# Altium schematic sheet Main.SchDoc
size A3
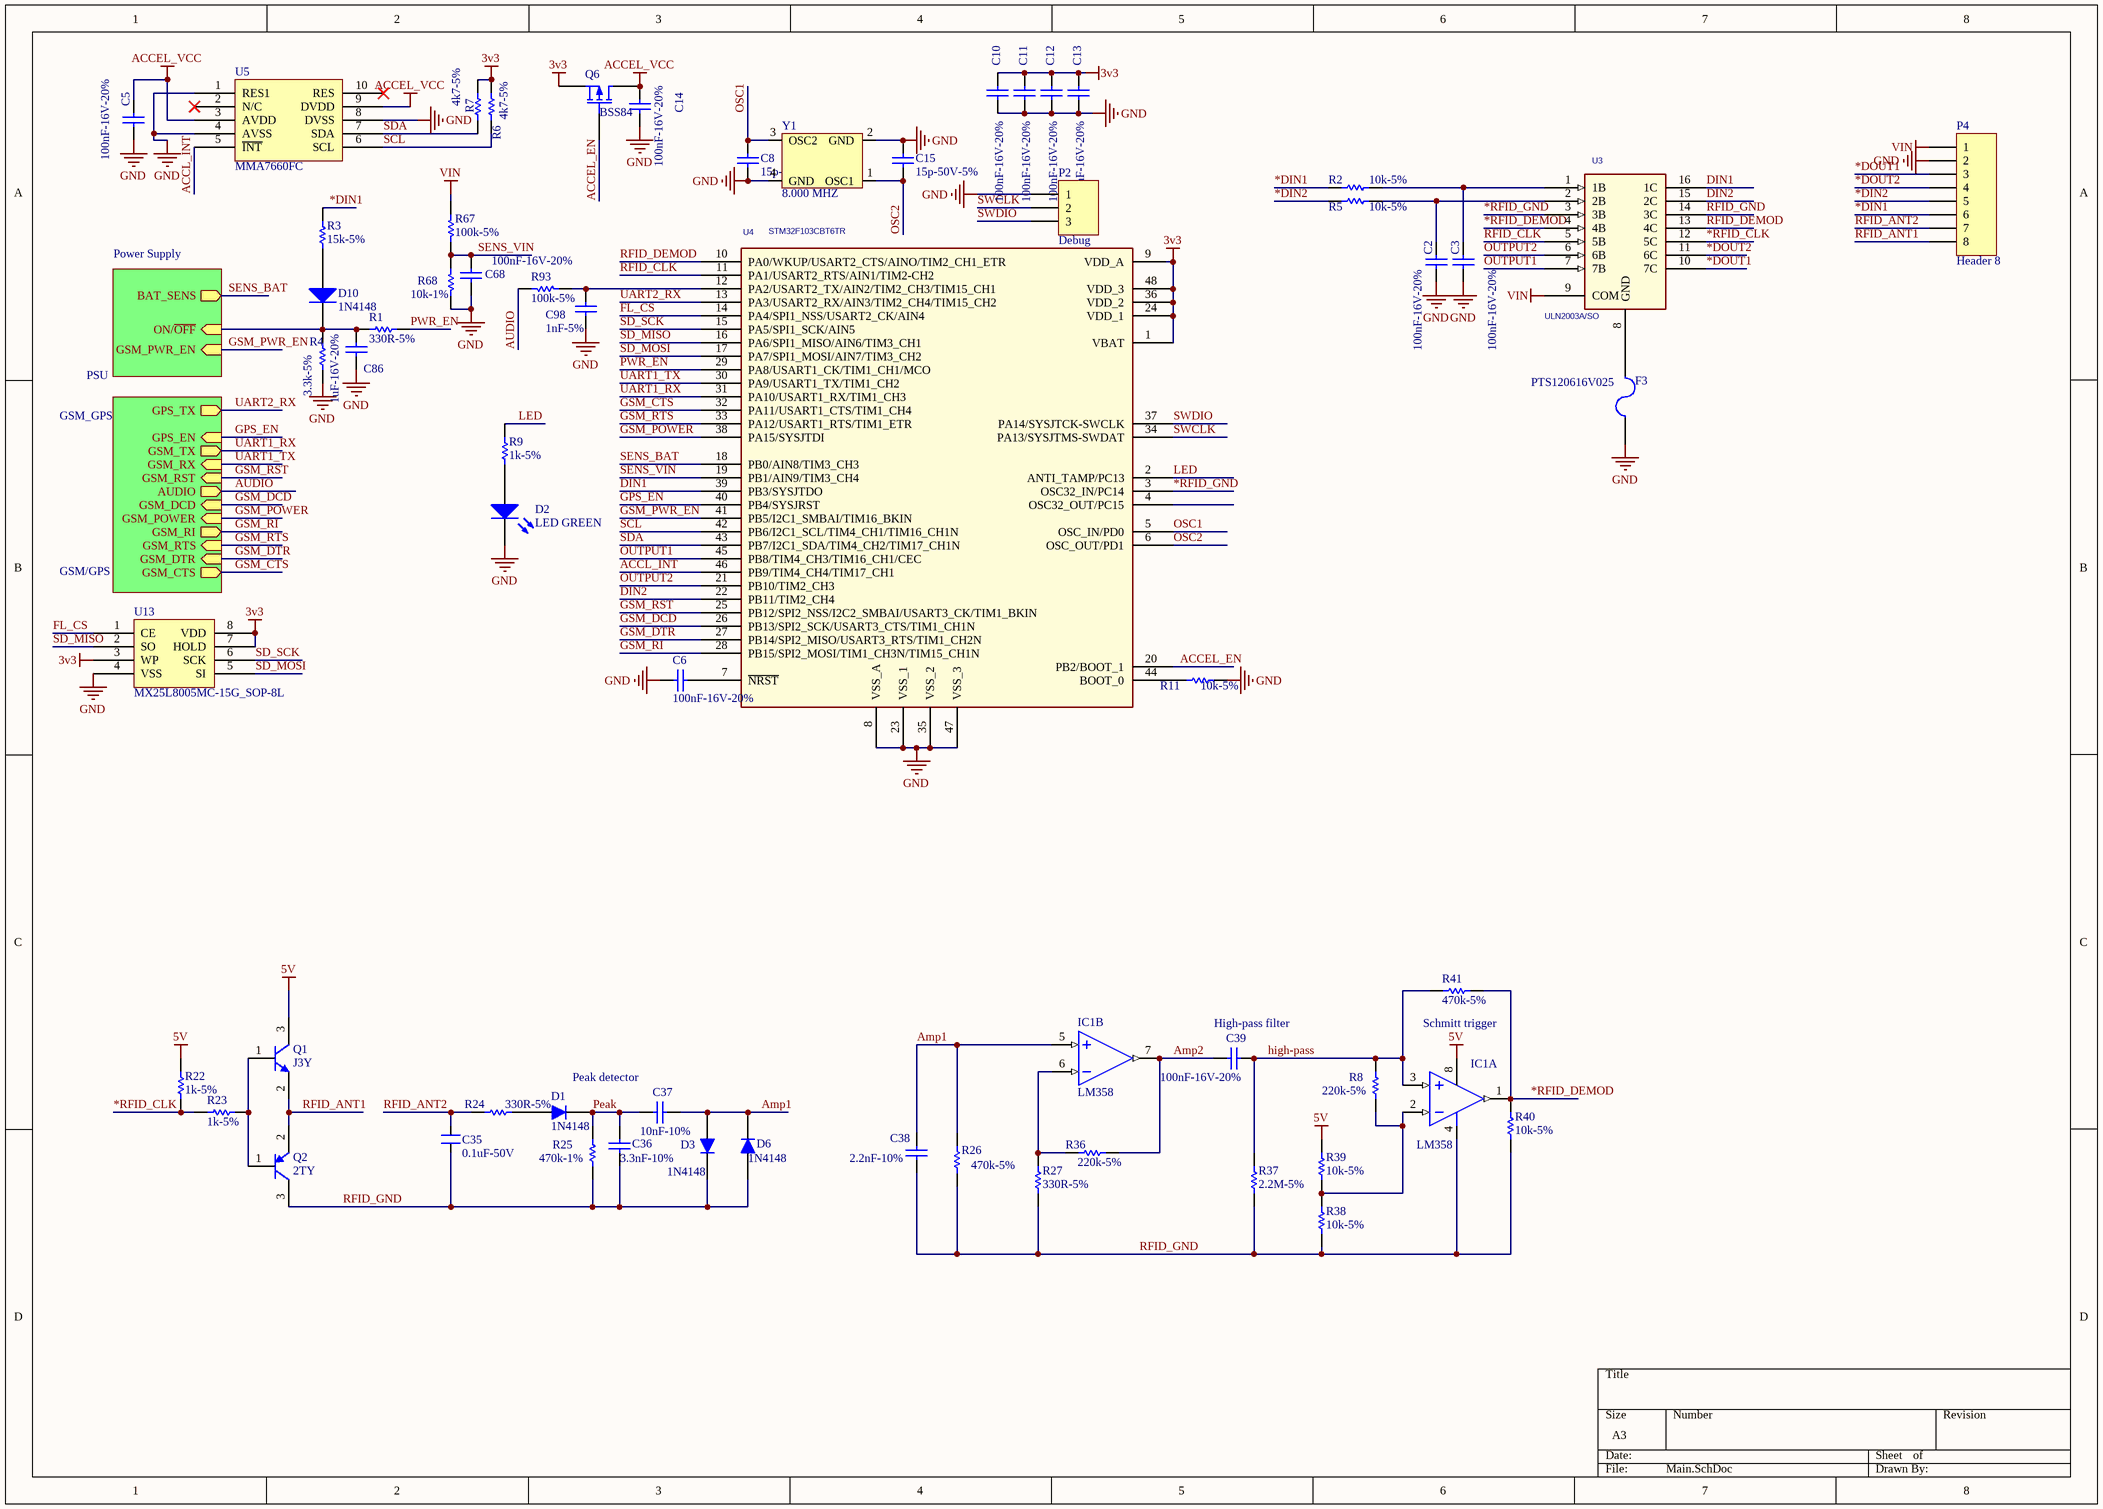
[diagram p0: Main.SchDoc]

## Parts
C2  100nF-16V-20%  [0402_TYPE1]
C3  100nF-16V-20%  [0402_TYPE1]
C5  100nF-16V-20%  [0402_TYPE1]
C6  100nF-16V-20%  [0402_TYPE1]
C8  15p-50V-5%  [0402_TYPE1]
C10  100nF-16V-20%  [0402_TYPE1]
C11  100nF-16V-20%  [0402_TYPE1]
C12  100nF-16V-20%  [0402_TYPE1]
C13  100nF-16V-20%  [0402_TYPE1]
C14  100nF-16V-20%  [0402_TYPE1]
C15  15p-50V-5%  [0402_TYPE1]
C35  0.1uF-50V  [C0805 - TYPE3]
C36  3.3nF-10%  [0402_TYPE1]
C37  10nF-10%  [0402_TYPE1]
C38  2.2nF-10%  [0402_TYPE1]
C39  100nF-16V-20%  [0402_TYPE1]
C68  100nF-16V-20%  [0402_TYPE1]
C86  1uF-16V-20%  [0402_TYPE1]
C98  1nF-5%  [0402_TYPE1]
D1  1N4148  [DO-213AA]
D2  LED GREEN  [LED0603-G]
D3  1N4148  [DO-213AA]
D6  1N4148  [DO-213AA]
D10  1N4148  [SOD323]
F3  PTS120616V025  [PTC1206]
IC1  LM358  [soic8]  (parts A,B of 2)
P2  Debug  [HEADER_1.27mm_3PIN]
P4  Header 8  [HDR1X8]
Q1  J3Y  [SOT23_123]
Q2  2TY  [SOT23_123]
Q6  BSS84  [SOT23-3]
R1  330R-5%  [R0402_TYPE1]
R2  10k-5%  [R0402_TYPE1]
R3  15k-5%  [R0402_TYPE1]
R4  3.3k-5%  [R0402_TYPE1]
R5  10k-5%  [R0402_TYPE1]
R6  4k7-5%  [R0402_TYPE1]
R7  4k7-5%  [R0402_TYPE1]
R8  220k-5%  [R0402_TYPE1]
R9  1k-5%  [R0402_TYPE1]
R11  10k-5%  [R0402_TYPE1]
R22  1k-5%  [R0402_TYPE1]
R23  1k-5%  [R0402_TYPE1]
R24  330R-5%  [R0402_TYPE1]
R25  470k-1%  [R0402_TYPE1]
R26  470k-5%  [R0402_TYPE1]
R27  330R-5%  [R0402_TYPE1]
R36  220k-5%  [R0402_TYPE1]
R37  2.2M-5%  [R0402_TYPE1]
R38  10k-5%  [R0402_TYPE1]
R39  10k-5%  [R0402_TYPE1]
R40  10k-5%  [R0402_TYPE1]
R41  470k-5%  [R0402_TYPE1]
R67  100k-5%  [R0402_TYPE1]
R68  10k-1%  [R0402_TYPE1]
R93  100k-5%  [R0402_TYPE1]
U3  ULN2003A/SO  [SO16-150mil]
U4  STM32F103CBT6TR  [TQFP-48-P0.5]
U5  MMA7660FC  [MMA7660FC]
U13  MX25L8005MC-15G_SOP-8L  [SO8-200mil]
Y1  8.000 MHZ  [SMD CRYSTAL 4 x 2.5]

## Sub-sheets
GSM/GPS = GSM_GPS: GSM_POWER (in), GSM_RX (in), GSM_TX (out), GPS_TX (out), GSM_DCD (in), GSM_RI (out), GPS_EN (in), GSM_RST (in), GSM_RTS (in), GSM_DTR (in), GSM_CTS (out), AUDIO (out)
Power Supply = PSU: ON/~{OFF} (in), GSM_PWR_EN (in), BAT_SENS (out)

## Nets
3v3: C10.1 C11.1 C12.1 C13.1 Q6.2(S) R6.2 R7.2 U4.1(VBAT) U4.9(VDD_A) U4.24(VDD_1) U4.36(VDD_2) U4.48(VDD_3) U13.3(WP) U13.7(HOLD) U13.8(VDD)
5V: IC1.8(+V) Q1.3(C) R22.2 R39.1
ACCEL_VCC: C5.2 C14.2 Q6.3(D) U5.3(AVDD) U5.9(DVDD)
GND: C2.2 C3.2 C5.1 C6.2 C8.1 C10.2 C11.2 C12.2 C13.2 C14.1 C15.2 C68.1 C86.1 C98.1 D2.2(K) F3.2 P2.1 P4.2 R4.1 R11.1 R68.1 U4.8(VSS_A) U4.23(VSS_1) U4.35(VSS_2) U4.47(VSS_3) U5.1(RES1) U5.4(AVSS) U5.8(DVSS) U13.4(VSS) Y1.2(GND) Y1.4(GND)
VIN: P4.1 R67.1 U3.9(COM)
*DIN1: P4.6 R2.2 R3.2
*DIN2: P4.5 R5.2
*DOUT1: P4.3 U3.10(7C)
*DOUT2: P4.4 U3.11(6C)
*RFID_CLK: R22.1 R23.2 U3.12(5C)
*RFID_DEMOD: IC1.1(OUT) R40.2 R41.1 U3.4(4B)
*RFID_GND: U3.3(3B) U4.3(OSC32_IN/PC14)
ACCEL_EN: Q6.1(G) U4.20(PB2/BOOT_1)
ACCL_INT: U4.46(PB9/TIM4_CH4/TIM17_CH1) U5.5(~{INT})
Amp1: C37.2 C38.2 D3.1(A) D6.2(K) IC1.5(IN+) R26.1
Amp2: C39.2 IC1.7(OUT) R36.1
AUDIO: R93.1 ; sheet GSM/GPS/AUDIO
DIN1: U3.16(1C) U4.39(PB3/SYSJTDO)
DIN2: U3.15(2C) U4.22(PB11/TIM2_CH4)
FL_CS: U4.14(PA4/SPI1_NSS/USART2_CK/AIN4) U13.1(CE)
GPS_EN: U4.40(PB4/SYSJRST) ; sheet GSM/GPS/GPS_EN
GSM_CTS: U4.32(PA11/USART1_CTS/TIM1_CH4) ; sheet GSM/GPS/GSM_CTS
GSM_DCD: U4.26(PB13/SPI2_SCK/USART3_CTS/TIM1_CH1N) ; sheet GSM/GPS/GSM_DCD
GSM_DTR: U4.27(PB14/SPI2_MISO/USART3_RTS/TIM1_CH2N) ; sheet GSM/GPS/GSM_DTR
GSM_POWER: U4.38(PA15/SYSJTDI) ; sheet GSM/GPS/GSM_POWER
GSM_PWR_EN: U4.41(PB5/I2C1_SMBAI/TIM16_BKIN) ; sheet Power Supply/GSM_PWR_EN
GSM_RI: U4.28(PB15/SPI2_MOSI/TIM1_CH3N/TIM15_CH1N) ; sheet GSM/GPS/GSM_RI
GSM_RST: U4.25(PB12/SPI2_NSS/I2C2_SMBAI/USART3_CK/TIM1_BKIN) ; sheet GSM/GPS/GSM_RST
GSM_RTS: U4.33(PA12/USART1_RTS/TIM1_ETR) ; sheet GSM/GPS/GSM_RTS
high-pass: C39.1 IC1.3(IN+) R8.2 R37.2 R41.2
LED: R9.2 U4.2(ANTI_TAMP/PC13)
OSC1: C8.2 U4.5(OSC_IN/PD0) Y1.3(OSC2)
OSC2: C15.1 U4.6(OSC_OUT/PD1) Y1.1(OSC1)
OUTPUT1: U3.7(7B) U4.45(PB8/TIM4_CH3/TIM16_CH1/CEC)
OUTPUT2: U3.6(6B) U4.21(PB10/TIM2_CH3)
Peak: C36.1 C37.1 D1.2(K) R25.1
PWR_EN: R1.1 U4.29(PA8/USART1_CK/TIM1_CH1/MCO)
RFID_ANT1: P4.8 Q1.2(E) Q2.2(E)
RFID_ANT2: C35.2 P4.7 R24.2
RFID_CLK: U3.5(5B) U4.11(PA1/USART2_RTS/AIN1/TIM2-CH2)
RFID_DEMOD: U3.13(4C) U4.10(PA0/WKUP/USART2_CTS/AINO/TIM2_CH1_ETR)
RFID_GND: C35.1 C36.2 C38.1 D3.2(K) D6.1(A) IC1.4(-V) Q2.3(C) R25.2 R26.2 R27.1 R37.1 R38.2 R40.1 U3.14(3C)
SCL: R6.1 U4.42(PB6/I2C1_SCL/TIM4_CH1/TIM16_CH1N) U5.6(SCL)
SD_MISO: U4.16(PA6/SPI1_MISO/AIN6/TIM3_CH1) U13.2(SO)
SD_MOSI: U4.17(PA7/SPI1_MOSI/AIN7/TIM3_CH2) U13.5(SI)
SD_SCK: U4.15(PA5/SPI1_SCK/AIN5) U13.6(SCK)
SDA: R7.1 U4.43(PB7/I2C1_SDA/TIM4_CH2/TIM17_CH1N) U5.7(SDA)
SENS_BAT: U4.18(PB0/AIN8/TIM3_CH3) ; sheet Power Supply/BAT_SENS
SENS_VIN: C68.2 R67.2 R68.2 U4.19(PB1/AIN9/TIM3_CH4)
SWCLK: P2.2 U4.34(PA13/SYSJTMS-SWDAT)
SWDIO: P2.3 U4.37(PA14/SYSJTCK-SWCLK)
UART1_RX: U4.31(PA10/USART1_RX/TIM1_CH3) ; sheet GSM/GPS/GSM_TX
UART1_TX: U4.30(PA9/USART1_TX/TIM1_CH2) ; sheet GSM/GPS/GSM_RX
UART2_RX: U4.13(PA3/USART2_RX/AIN3/TIM2_CH4/TIM15_CH2) ; sheet GSM/GPS/GPS_TX
NetC2_1: C2.1 R5.1 U3.2(2B)
NetC3_1: C3.1 R2.1 U3.1(1B)
NetC6_1: C6.1 U4.7(~{NRST})
NetC86_2: C86.2 D10.2(K) R1.2 R4.2 ; sheet Power Supply/ON/~{OFF}
NetC98_2: C98.2 R93.2 U4.12(PA2/USART2_TX/AIN2/TIM2_CH3/TIM15_CH1)
NetD1_1: D1.1(A) R24.1
NetD2_1: D2.1(A) R9.1
NetD10_1: D10.1(A) R3.1
NetF3_1: F3.1 U3.8(GND)
NetIC1_2: IC1.2(IN-) R8.1 R38.1 R39.2
NetIC1_6: IC1.6(IN-) R27.2 R36.2
NetQ1_1: Q1.1(B) Q2.1(B) R23.1
NetR11_2: R11.2 U4.44(BOOT_0)

Not connected (* = marked no-connect by the designer): U4 4(OSC32_OUT/PC15); U5 2(N/C)* 10(RES)*

## Notes on the sheet
- (near C39) High-pass filter
- (near R41) Schmitt trigger
- Peak detector

## Library data of the parts
C2 C3 C5 C6 C10-C14 C39 C68 = Cap: CAP CER 0.1UF 16V Y5V 0402; Manufacturer: Yageo; Manufacturer Part Number: CC0402ZRY5V7BB104; Published: 8-Jun-2000; LatestRevisionDate: 17-Jul-2002; LatestRevisionNote: Re-released for DXP Platform.; PackageReference: C0402; Publisher: Altium Limited; Value: 100nF-16V-20%; Digi-Key Part Number: 311-1047-1-ND; Unit Price: 0.00250
C8 C15 = Cap: CAP CER 15PF 50V 5% NPO 0402; Manufacturer: Yageo; Manufacturer Part Number: CC0402JRNPO9BN150; Published: 8-Jun-2000; LatestRevisionDate: 17-Jul-2002; LatestRevisionNote: Re-released for DXP Platform.; PackageReference: C0402; Publisher: Altium Limited; Value: 15p-50V-5%; Digi-Key Part Number: 311-1017-1-ND; Unit Price: 0.00270
C35 = CN2: CAP CER 0.1UF 50V Y5V 0603; Manufacturer: Yageo; Manufacturer Part Number: CC0603ZRY5V9BB104; Digi-Key Part Number: 311-1343-2-ND; Unit Price: 0.00327; Value: 0.1uF-50V
C36 = 1nF-50V-C0805: CAP CER 3300PF 50V 10% X7R 0402; Manufacturer: Yageo; Manufacturer Part Number: CC0402KRX7R9BB332; Value: 3.3nF-10%; Digi-Key Part Number: 311-1034-2-ND; Unit Price: 0.00305
C37 = 10nF-50V-C0805: Non-Polarized Capacitor; Manufacturer: Yageo; Manufacturer Part Number: 311-1349-2-ND; Value: 10nF-10%; Digi-Key Part Number: CC0402KRX7R9BB103; Unit Price: 0.00221
C38 = 2.2nF-50V-C0805: CAP CER 2200PF 50V 10% X7R 0402; Manufacturer: Yageo; Manufacturer Part Number: CC0402KRX7R9BB222; Value: 2.2nF-10%; Digi-Key Part Number: 311-1037-2-ND; Unit Price: 0.00281
C86 = Cap: CAP CER 1UF 16V Y5V 0603; Manufacturer: Yageo; Manufacturer Part Number: CC0603ZRY5V7BB105; Published: 8-Jun-2000; LatestRevisionDate: 17-Jul-2002; LatestRevisionNote: Re-released for DXP Platform.; PackageReference: C0603; Publisher: Altium Limited; Value: 1uF-16V-20%; Digi-Key Part Number: 311-1372-1-ND; Unit Price: 0.00465
C98 = 1nF-50V-C0805: Non-Polarized Capacitor; Manufacturer: Yageo; Manufacturer Part Number: CC0805JRNPO9BN102; Value: 1nF-5%; Digi-Key Part Number: 311-1122-1-ND; Unit Price: 0.18
D1 D3 D6 = 1N4148: DIODE SMALL SIG 100V 0.2A ALF2; Manufacturer: NXP Semiconductors; Manufacturer Part Number: 1N4148,113; Digi-Key Part Number: 568-1360-1-ND; Unit Price: 0.08100
D2 = LED2: LED GREEN CLEAR THIN 0603 SMD; Manufacturer: Lite-On Inc; Manufacturer Part Number: LTST-C191KGKT; Published: 8-Jun-2000; LatestRevisionDate: 17-Jul-2002; LatestRevisionNote: Re-released for DXP Platform.; PackageVersion: Feb-2002; PackageReference: 3.2X1.6X1.1; Publisher: Altium Limited; Digi-Key Part Number: 160-1446-2-ND; Unit Price: 0.03780; Value: LED GREEN
D10 = Diode: DIODE SWITCH 75V 200MW SOD323; Manufacturer Part Number: 1N4148WS-7-F; Manufacturer: Diodes Inc; Value: 1N4007; Published: 8-Jun-2000; LatestRevisionDate: 17-Jul-2002; LatestRevisionNote: Re-released for DXP Platform.; PackageVersion: Sep-1996; PackageReference: DO-214-AA; Publisher: Altium Limited; Code_JEDEC: DO-214-AB; Digi-Key Part Number: 1N4148WS-FDITR-ND; Unit Price: 0.02933
F3 = Fuse 2: PTC RESETTABLE SMD 1206 16V .25A; Manufacturer: Cooper Bussmann; Published: 8-Jun-2000; LatestRevisionDate: 17-Jul-2002; LatestRevisionNote: Re-released for DXP Platform.; PackageReference: PIN-W2/E2.8; Publisher: Altium Limited; Digi-Key Part Number: 283-3137-2-ND; Manufacturer Part Number: 120616V025; Unit Price: 0.12375; Value: PTS120616V025; tme part: SMD1815P050TF
IC1 = LM358: Low-Power Dual Operational Amplifier; Value: LM358
P2 = Header 3: NA; LatestRevisionDate: 17-Jul-2002; LatestRevisionNote: Re-released for DXP Platform.; Publisher: Altium Limited
P4 = Header 8: Header, 8-Pin; LatestRevisionDate: 17-Jul-2002; LatestRevisionNote: Re-released for DXP Platform.; Publisher: Altium Limited
Q1 = NPN_123: NPN Bipolar Transistor
Q2 = PNP_123: PNP Bipolar Transistor
Q6 = MOSFET-P: MOSFET P-CH 50V 130MA SOT23-3; Manufacturer: Diodes Inc; Manufacturer Part Number: BSS84-7-F; Published: 8-Jun-2000; LatestRevisionDate: 17-Jul-2002; LatestRevisionNote: Re-released for DXP Platform.; PackageVersion: 1995/1996; PackageReference: E3; Publisher: Altium Limited; Digi-Key Part Number: BSS84-FDITR-ND; Unit Price: 0.06000
R1 R27 = 330R-5%-R0805: RES 330 OHM 1/8W 5% 0805 SMD; Manufacturer: Yageo; Manufacturer Part Number: RC0805JR-07330RL; Digi-Key Part Number: 311-330ARTR-ND; Unit Price: 0.00209
R2 R5 R38-R40 = 10k-5%-R0805: RES 10k OHM 1/8W 5% 0805 SMD; Manufacturer: Yageo; Manufacturer Part Number: RC0805JR-0710KL; Digi-Key Part Number: 311-10KARTR-ND; Unit Price: 0.00209
R3 = 105k-1%-R0805: RES 105k OHM 1/4W 1% 0805 SMD; Manufacturer: Yageo; Manufacturer Part Number: RC0805FR-07105KL; Digi-Key Part Number: 311-105KCRTR-ND; Unit Price: 0.00241
R4 = 26.1k-1%-R0805: RES 26.1k OHM 1/4W 1% 0805 SMD; Manufacturer: Yageo; Manufacturer Part Number: RC0805FR-0726K1L; Digi-Key Part Number: 311-26.1KCRTR-ND; Unit Price: 0.00241
R6 R7 = Res1: RES 4.7K OHM 1/16W 5% 0402 SMD; Manufacturer: Yageo; Manufacturer Part Number: RC0402JR-074K7L; Published: 8-Jun-2000; LatestRevisionDate: 17-Jul-2002; LatestRevisionNote: Re-released for DXP Platform.; PackageReference: R0603; Publisher: Altium Limited; Value: 4k7-5%; Digi-Key Part Number: 311-4.7KJRCT-ND; Unit Price: 0.00178
R8 R36 = 220k-5%-R0805: RES 220k OHM 1/8W 5% 0805 SMD; Manufacturer: Yageo; Manufacturer Part Number: RC0805JR-07220KL; Digi-Key Part Number: 311-220KARTR-ND; Unit Price: 0.00209
R9 = Res1: RES 1.0K OHM 1/16W 5% 0402 SMD; Manufacturer: Yageo; Manufacturer Part Number: RC0402JR-071KL; Published: 8-Jun-2000; LatestRevisionDate: 17-Jul-2002; LatestRevisionNote: Re-released for DXP Platform.; PackageReference: R0603; Publisher: Altium Limited; Value: 1k-5%; Digi-Key Part Number: 311-1.0KJRCT-ND; Unit Price: 0.00178
R11 = Res1: RES 10K OHM 1/16W 5% 0402 SMD; Manufacturer: Yageo; Manufacturer Part Number: RC0402JR-0710KL; Published: 8-Jun-2000; LatestRevisionDate: 17-Jul-2002; LatestRevisionNote: Re-released for DXP Platform.; PackageReference: R0603; Publisher: Altium Limited; Value: 10k-5%; Digi-Key Part Number: 311-10KJRCT-ND; Unit Price: 0.00178
R22 R23 = 1k-5%-R0805: RES 1k OHM 1/8W 5% 0805 SMD; Manufacturer: Yageo; Manufacturer Part Number: RC0805JR-071KL; Digi-Key Part Number: 311-1.0KARTR-ND; Unit Price: 0.00209
R24 = 330k-5%-R0805: RES 330 OHM 1/8W 5% 0805 SMD; Manufacturer: Yageo; Manufacturer Part Number: RC0805JR-07330RL; Digi-Key Part Number: 311-330ARTR-ND; Unit Price: 0.00209
R25 = 470k-1%-R0805: RES 470k OHM 1/4W 1% 0805 SMD; Manufacturer: Yageo; Manufacturer Part Number: RC0805FR-07470KL; Digi-Key Part Number: 311-470KCRTR-ND; Unit Price: 0.00241
R26 R41 = 470k-5%-R0805: RES 470k OHM 1/8W 5% 0805 SMD; Manufacturer: Yageo; Manufacturer Part Number: RC0805JR-07470KL; Digi-Key Part Number: 311-470KARTR-ND; Unit Price: 0.00209
R37 = 2.2M-5%-R0805: RES 2.2M OHM 1/8W 5% 0805 SMD; Manufacturer: Yageo; Manufacturer Part Number: RC0805JR-072M2L; Digi-Key Part Number: 311-2.2MARTR-ND; Unit Price: 0.00209
R67 R93 = Res1: RES 100K OHM 1/16W 5% 0402 SMD; Manufacturer: Yageo; Manufacturer Part Number: RC0402JR-07100KL; Published: 8-Jun-2000; LatestRevisionDate: 17-Jul-2002; LatestRevisionNote: Re-released for DXP Platform.; PackageReference: R0402; Publisher: Altium Limited; Value: 100k-5%; Digi-Key Part Number: 311-100KJRCT-ND; Unit Price: 0.00171
R68 = Res1: RES 10.0K OHM 1/16W 1% 0402 SMD; Manufacturer: Yageo; Manufacturer Part Number: RC0402FR-0710KL; Published: 8-Jun-2000; LatestRevisionDate: 17-Jul-2002; LatestRevisionNote: Re-released for DXP Platform.; PackageReference: R0603; Publisher: Altium Limited; Value: 10k-1%; Digi-Key Part Number: 311-10.0KLRTR-ND; Unit Price: 0.00149
U3 = ULN2003A/SO_0: IC DARL TRANS ARRAY 16-SOIC; Manufacturer Part Number: ULN2003ADR; Manufacturer: Texas Instruments; Digi-Key Part Number: 296-1368-2-ND; Unit Price: 0.144
U4 = ATmega128_4: MCU ARM 128K FLASH/TIMER; Manufacturer: STMicroelectronics; Digi-Key Part Number: 497-6288-ND; Manufacturer Part Number: STM32F103CBT6TR; Unit Price: 2
U5 = MMA7660FC: ACCELEROMETER 3X3 DGTL 10-DFN; Manufacturer: Freescale Semiconductor; Manufacturer Part Number: MMA7660FCT; Unit Price: 0.67000; Digi-Key Part Number: MMA7660FCT-ND
U13 = FlashIC: Manufacturer: Tyrone
Y1 = CRYSTAL-SMT: CRYSTAL 8.000 MHZ 18PF SMD; Manufacturer: TXC CORPORATION; Manufacturer Part Number: 7B-8.000MAAJ-T; Digi-Key Part Number: 887-1452-2-ND; Unit Price: 0.39000; Value: 8.000 MHZ